# Altium project ECE453-SPI.PrjPcb
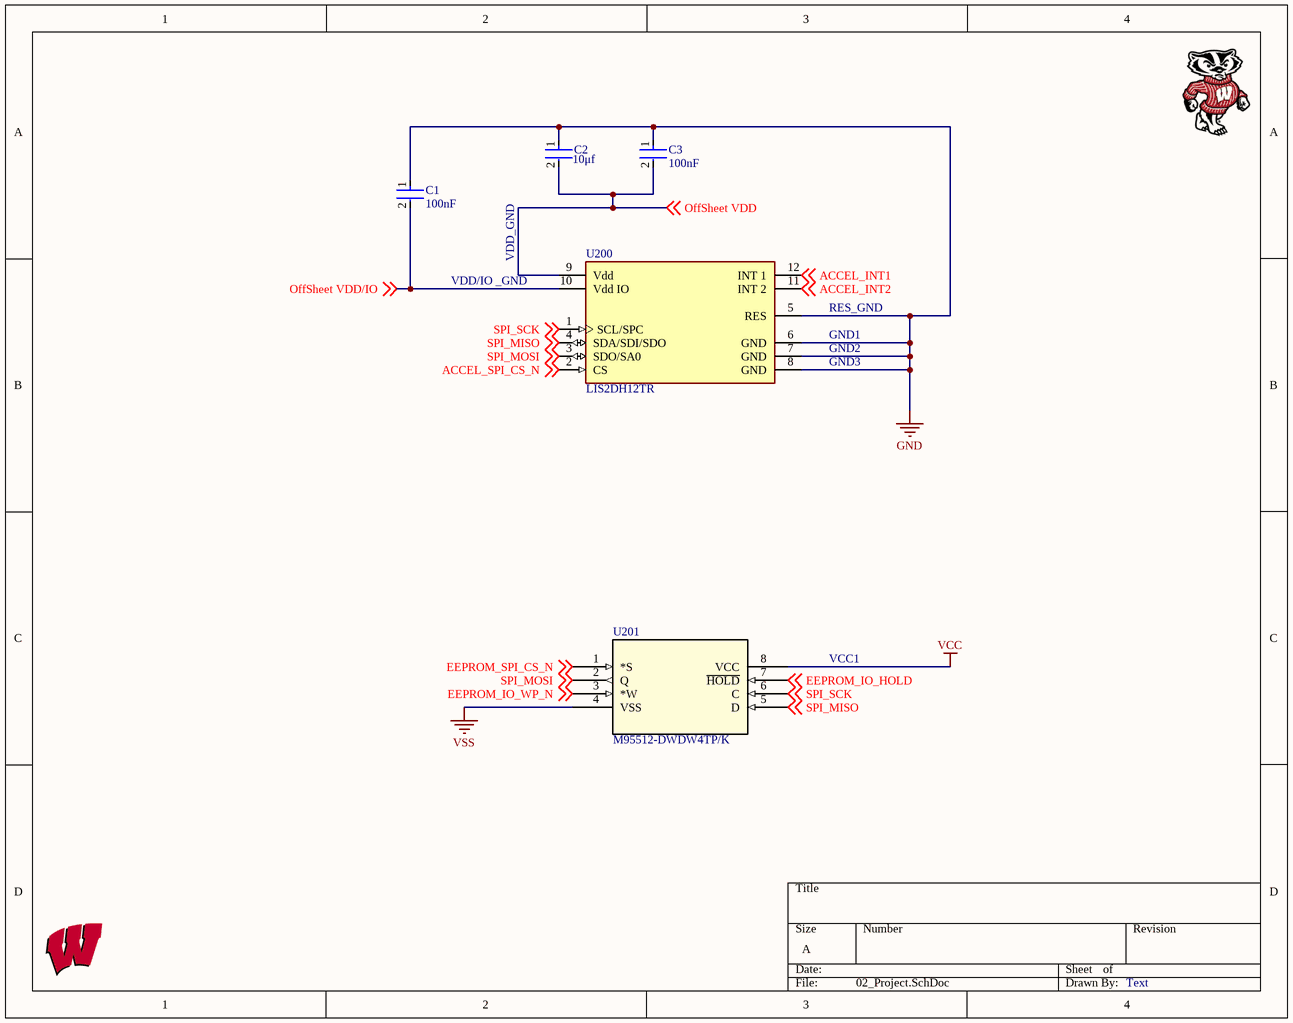
[diagram p0: 02_Project.SchDoc]
3 sheets, 28 parts. Net scope: global (net labels, ports and power ports of the same name join across sheets).
Board file: ECE453.PcbDoc
Sheets:
  02_Project.SchDoc
  03_Mechanicals.SchDoc
  SPI Title Page.SchDoc

## Sheet 02_Project.SchDoc
size A; ApprovedDate: 04/02/2019; AssemblyNumber: ECE315-F19

### Parts
C1  100nF  [FP-C0805C-DN-MFG]
C2  10μf  [FP-GRM21B-0_15-IPC_C]
C3  100nF  [FP-C0805C-DN-MFG]
U200  LIS2DH12TR  [FP-LGA-12-8365767-MFG]
U201  M95512-DWDW4TP/K  [TSSOP8_169MILS_DW_STM-M]

### Nets
GND: C1.1 C2.1 C3.1 U200.5(RES) U200.6(GND) U200.7(GND) U200.8(GND)
VCC: U201.8(VCC)
VSS: U201.4(VSS)
ACCEL_INT1: U200.12(INT_1) ; off-sheet ACCEL_INT1
ACCEL_INT2: U200.11(INT_2) ; off-sheet ACCEL_INT2
ACCEL_SPI_CS_N: U200.2(CS) ; off-sheet ACCEL_SPI_CS_N
EEPROM_IO_HOLD: U201.7(~{HOLD}) ; off-sheet EEPROM_IO_HOLD
EEPROM_IO_WP_N: U201.3(*W) ; off-sheet EEPROM_IO_WP_N
EEPROM_SPI_CS_N: U201.1(*S) ; off-sheet EEPROM_SPI_CS_N
OffSheet VDD: C2.2 C3.2 U200.9(Vdd) ; off-sheet OffSheet VDD
OffSheet VDD/IO: C1.2 U200.10(Vdd_IO) ; off-sheet OffSheet VDD/IO
SPI_MISO: U200.4(SDA/SDI/SDO) U201.5(D) ; off-sheet SPI_MISO
SPI_MOSI: U200.3(SDO/SA0) U201.2(Q) ; off-sheet SPI_MOSI
SPI_SCK: U200.1(SCL/SPC) U201.6(C) ; off-sheet SPI_SCK

### Notes on the sheet
- VDD/IO _GND
- VDD_GND
- GND1
- GND2
- GND3
- RES_GND
- VCC1
- Text

### Library data of the parts
C1 C3 = CMP-2007-00279-2: CAP CER 0.1UF 50V X7R 0805; Manufacturer Part Number: C0805C104K5RACTU; Manufacturer: KEMET; Value: 0.10 μF; Tolerance: 0.1; Temperature Coefficient: 30ppm/°C; Material: Ceramic; Device Class L2: Capacitors; Temperature Range Low: -55°C; Voltage Rating: 50 V; Digikey Description: CAP CER 0.1UF 50V X7R 0805; Category: Cap; ComponentLink2Description: Datasheet; Octopart: https://octopart.com/c0805c104k5ractu-kemet-143926; RoHS: TRUE; ComponentLink2URL: https://content.kemet.com/datasheets/KEM_C1003_C0G_SMD.pdf; Temperature Characteristic: X7R; Temperature: -55°C to +125°C; Height: 0.88mm; Temperature Range High: +125°C; Device Class L1: Passive Components; Automotive: No; Lead Free: Yes; Ipc Land Pattern Name: CAPC200125X78; Device Class L3: Ceramic Capacitors; Mouser Description: Cap Ceramic 0.1uF 50V X7R 10% SMD 2.0 x 1.2 mm 125 C Paper T/R; Capacitance: 0.10 μF; Package: C0805C-DN
C2 = CMP-2007-03541-2: Chip Multilayer Ceramic Capacitors for General Purpose, 0805, 10uF, X5R, 15%, 10%, 25V; Parameter 1: C1; Length: 2mm; Depth: 1.25mm; Termination: SMD/SMT; Voltage: 25V; Height: 1.25mm; Material: Ceramic; Thickness: 0.053inch; Radiation Hardening: No; Min Operating Temperature: -55°C; Width: 0.049inch; Package Quantity: 1; Mount: Surface Mount; Dielectric: X5R; Packaging: Tape and Reel; Capacitance: 10uF; Voltage Rating (DC): 25V; Lead Free: Lead Free; Max Operating Temperature: 85°C; Case Code (Imperial): 0805; Case/Package: 0805; Tolerance: 10%; Voltage Rating: 25V; Case Code (Metric): 2012
U200 = CMP-2000-05369-2: ACCEL 2-16G I2C/SPI 12LGA; Manufacturer 1: STMicroelectronics; Output Type: SPI; Axis: X, Y, Z; Interface: I2C; Max Supply Voltage: 3.6V; Bandwidth: 672Hz; Min Supply Voltage: 1.71V; Min Operating Temperature: -40°C; Width: 2.15mm; Lead Free: Lead Free; Case/Package: LGA; Contact Plating: Gold; Number of Pins: 12; Max Operating Temperature: 85°C; Packaging: Cut Tape; Radiation Hardening: No; Length: 2.15mm; REACH SVHC: No SVHC; Height: 1mm; Mount: Surface Mount; Supplier 1: Digi-Key; Supplier Part Number 1: 497-14851-1-ND; Manufacturer Part Number 1: LIS2DH12TR; RoHS: Yes; Category: Accelerometers; Stock 1: 3389; Pricing 1: 1=2.11000, 10=1.89800, 25=1.79080, 100=1.52590, 500=1.25364, 1000=1.19394 (USD); Series: -; Reach SVHC Compliant: Yes; RoHS Compliant: Yes; ComponentLink1URL: https://datasheet.ciiva.com/46423/1836729-46423946.pdf?src-supplier=Element14; ComponentLink1Description: https://datasheet.ciiva.com/46423/1836729-46423946.pdf?src-supplier=Element14
U201 = M95512-DWDW4TP/K: EEPROM Serial-SPI 512K-bit 64K x 8 3.3V/5V Automotive 8-Pin TSSOP T/R; Mfr_Name: STMicroelectronics; Interface: SPI,Serial; Access Time: 25ns; Density: 512Kb; Frequency: 10MHz; Min Supply Voltage: 2.5V; Max Supply Voltage: 5.5V; Max Frequency: 16MHz; Nominal Supply Current: 4mA; Copyright: Copyright (C) 2022 Ultra Librarian. All rights reserved.; Manufacturer_Part_Number: M95512-DWDW4TP/K; RefDes: RefDes; Type: DEV; Supplier 1: Digi-Key; Supplier Part Number 1: 497-14459-1-ND; Manufacturer 1: STMicroelectronics; Manufacturer Part Number 1: M95512-DWDW4TP/K; RoHS: Yes; Category: EEPROM; Stock 1: 11469; Pricing 1: 1=2.30000, 10=2.07100, 25=2.03920, 50=2.03400, 100=1.81740, 250=1.76084 (USD); Mount: Surface Mount; Case/Package: TSSOP; Number of Pins: 8; Min Operating Temperature: -40°C; Max Operating Temperature: 145°C; Packaging: Tape and Reel; Memory Type: EEPROM; Radiation Hardening: No; RoHS Compliant: Yes; ComponentLink1URL: https://datasheet.ciiva.com/29614/dm00046608-29614432.pdf?src-supplier=Digi-Key; ComponentLink1Description: https://datasheet.ciiva.com/29614/dm00046608-29614432.pdf?src-supplier=Digi-Key; ComponentLink2URL: https://datasheet.ciiva.com/48501/dm00046608-48501612.pdf?src-supplier=Avnet; ComponentLink2Description: https://datasheet.ciiva.com/48501/dm00046608-48501612.pdf?src-supplier=Avnet

## Sheet 03_Mechanicals.SchDoc
size A; ApprovedDate: 04/02/2019; AssemblyNumber: ECE315-F19
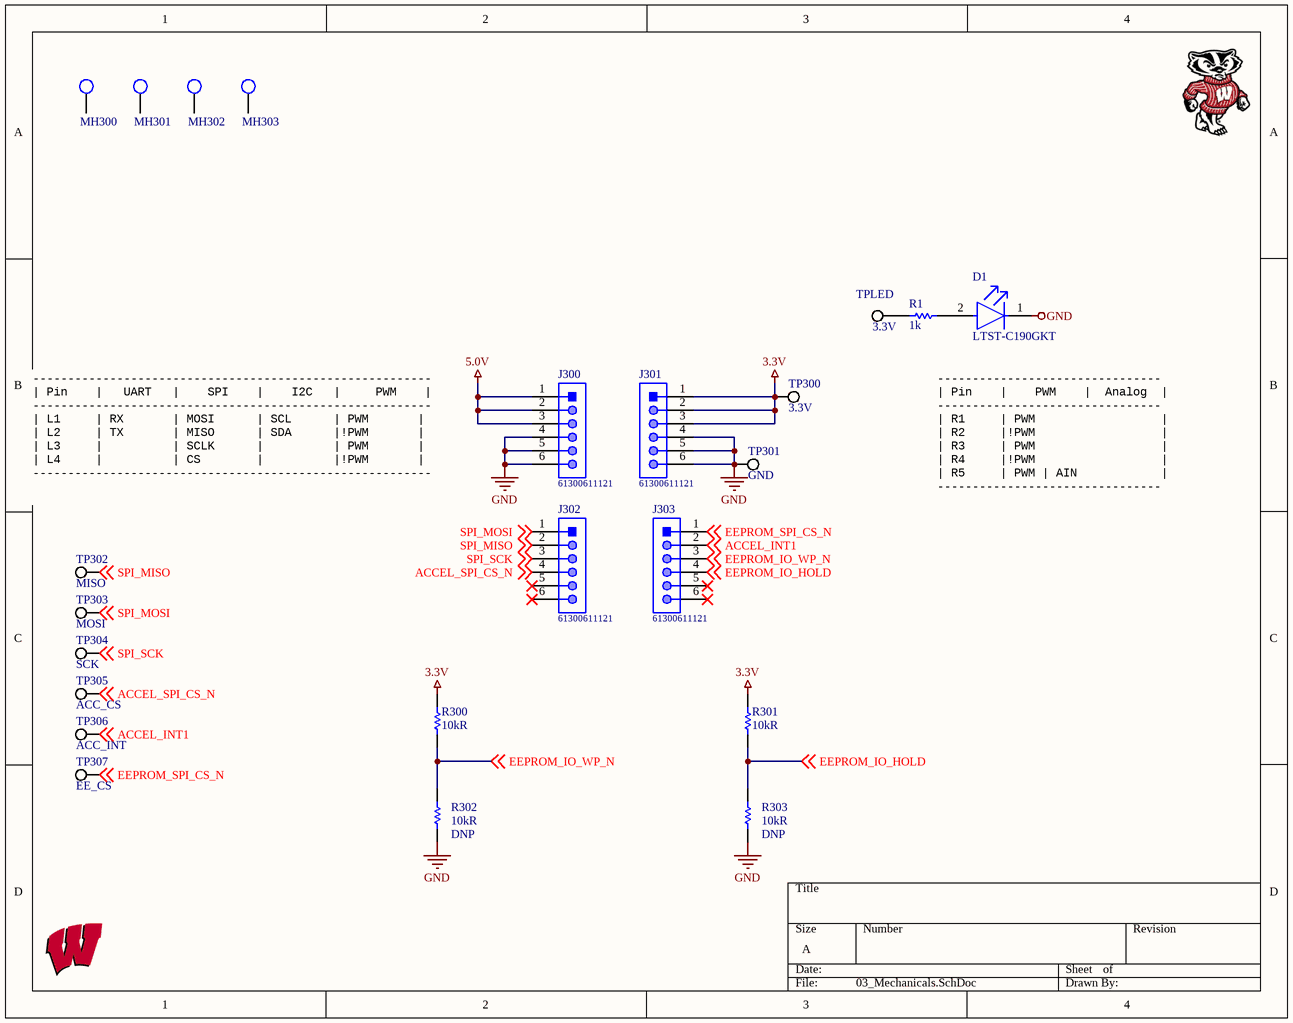
[diagram p1: 03_Mechanicals.SchDoc]

### Parts
D1  LTST-C190GKT  [FP-LTST-C190GKT-MFG]
J300  61300611121  [61300611121]
J301  61300611121  [61300611121]
J302  61300611121  [61300611121]
J303  61300611121  [61300611121]
MH300  MHOLE_2_55MM  [MHOLE_2_55MM]  (value not drawn)  (no BOM)
MH301  MHOLE_2_55MM  [MHOLE_2_55MM]  (value not drawn)  (no BOM)
MH302  MHOLE_2_55MM  [MHOLE_2_55MM]  (value not drawn)  (no BOM)
MH303  MHOLE_2_55MM  [MHOLE_2_55MM]  (value not drawn)  (no BOM)
R1  1k  [RESC2013X60X35ML10T20]
R300  Resistance: 10kR  [RESC2013X60X35NL10T20]  (hidden comment: RC0805FR-0710KL)
R301  Resistance: 10kR  [RESC2013X60X35NL10T20]  (hidden comment: RC0805FR-0710KL)
R302  DNP  Resistance: 10kR  [RESC2013X60X35NL10T20]  (no BOM)
R303  DNP  Resistance: 10kR  [RESC2013X60X35NL10T20]  (no BOM)
TP300  3.3V  [KSTN-5019_V]
TP301  GND  [KSTN-5019_V]
TP302  MISO  [KSTN-5019_V]
TP303  MOSI  [KSTN-5019_V]
TP304  SCK  [KSTN-5019_V]
TP305  ACC_CS  [KSTN-5019_V]
TP306  ACC_INT  [KSTN-5019_V]
TP307  EE_CS  [KSTN-5019_V]
TPLED  3.3V  [KSTN-5019_V]

### Nets
3.3V: J301.1 J301.2 J301.3 R300.1 R301.1 TP300.1
5.0V: J300.1 J300.2 J300.3
GND: D1.1(C) J300.4 J300.5 J300.6 J301.4 J301.5 J301.6 R302.2 R303.2 TP301.1
ACCEL_INT1: J303.2 TP306.1 ; off-sheet ACCEL_INT1
ACCEL_SPI_CS_N: J302.4 TP305.1 ; off-sheet ACCEL_SPI_CS_N
EEPROM_IO_HOLD: J303.4 R301.2 R303.1 ; off-sheet EEPROM_IO_HOLD
EEPROM_IO_WP_N: J303.3 R300.2 R302.1 ; off-sheet EEPROM_IO_WP_N
EEPROM_SPI_CS_N: J303.1 TP307.1 ; off-sheet EEPROM_SPI_CS_N
SPI_MISO: J302.2 TP302.1 ; off-sheet SPI_MISO
SPI_MOSI: J302.1 TP303.1 ; off-sheet SPI_MOSI
SPI_SCK: J302.3 TP304.1 ; off-sheet SPI_SCK
NetD1_2: D1.2(A) R1.1
NetR1_2: R1.2 TPLED.1

Not connected (* = marked no-connect by the designer): J302 5* 6*; J303 5* 6*; MH300 1; MH301 1; MH302 1; MH303 1

### Notes on the sheet
- ---------------------------------------------------------
  | Pin    |   UART   |    SPI    |    I2C   |     PWM    |
  ---------------------------------------------------------
  | L1     | RX       | MOSI      | SCL      | PWM       |
  | L2     | TX       | MISO      | SDA      |!PWM       |
  | L3     |          | SCLK      |          | PWM       |
  | L4     |          | CS        |          |!PWM       |
  ---------------------------------------------------------
- --------------------------------
  | Pin    |    PWM    |  Analog  |
  --------------------------------
  | R1     | PWM                  |
  | R2     |!PWM                  |
  | R3     | PWM                  |
  | R4     |!PWM                  |
  | R5     | PWM | AIN            |
  --------------------------------

### Library data of the parts
D1 = CMP-22017-000005-2: LED GREEN CLEAR CHIP SMD; Dominant Wavelength: 569nm; Reverse Voltage: 5V; Lens Color: Colorless; Viewing Angle: 130°; Voltage: 2V; Forward Current: 30mA; Power Dissipation: 100mW; Luminous Intensity: 6mcd; Number of LEDs: 1; Forward Voltage: 2.1V; Wavelength: 565nm; Test Current: 10mA; Min Operating Temperature: -55°C; Lens Style: Clear; Mount: Surface Mount; Width: 0.8mm; Packaging: Tape and Reel; Lens Transparency: Clear; Case Code (Metric): 1608; Depth: 0.8mm; Case Code (Imperial): 0603; Case/Package: 0603; Number of Pins: 2; Max Operating Temperature: 85°C; Lead Free: Lead Free; Number of Elements: 1; Length: 1.6mm; Height: 0.8mm; Package Quantity: 1; Power Rating: 100mW; Radiation Hardening: No; Illumination Color: Green; Color: Green
J300-J303 = CMP-1502-01070-1: THT Vertical Pin Header WR-PHD, Pitch 2.54 mm, Single Row, 6 pins; Manufacturer: Wurth Elektronik; Manufacturer 1: Wurth Electronics; Gender: Male; Pin Number: 6; Pitch: 2.54mm; Working Voltage: 250VAC; Rated Current: 3A; Withstanding Voltage: 500VAC; Contact Resistance: 20mOhm; Voltage Rating: 250V; Connector Type: Male Pin; Operating Temperature: -40to105degC; Packaging: Bag; Datasheet URL: https://katalog.we-online.de/em/datasheet/6130xx11121.pdf; Package Reference: 61300611121; Mounting Technology: THT; Publisher: WurthElektronik; Part Number: 61300611121; Manufacturer URL: http://www.we-online.de; Row Number: Single; Orientation: Vertical; Supplier 1: Digi-Key; Supplier Part Number 1: 732-5319-ND; Manufacturer Part Number 1: 61300611121; RoHS: Yes; Category: Headers and Wire Housings; Stock 1: 51753; Pricing 1: 1=0.35000, 10=0.29800, 25=0.24720, 50=0.20700, 100=0.18700, 1000=0.17100 (USD); Mount: Through Hole; Contact Plating: Gold; Contact Material: Copper Alloy,Copper; Housing Material: PBT; Color: Black; Min Operating Temperature: -40°C; Max Operating Temperature: 125°C; Number of Rows: 1; Contact Gender: Male; Current Rating: 3A; Number of Positions: 6; Termination: Through Hole; Number of Contacts: 6; Series: WR-PHD; Contact Type: Male Pin; Contact Mating Length: 0.236inch; Lead Free: Lead Free; RoHS Compliant: Yes; ComponentLink1URL: http://www.mouser.com/ds/2/445/6130xx11121-538006.pdf?src-supplier=Mouser; ComponentLink1Description: http://www.mouser.com/ds/2/445/6130xx11121-538006.pdf?src-supplier=Mouser; ComponentLink2URL: http://www.farnell.com/cad/1737268.pdf?src-supplier=Element14; ComponentLink2Description: http://www.farnell.com/cad/1737268.pdf?src-supplier=Element14; ComponentLink3URL: https://katalog.we-online.de/em/datasheet/6130xx11121.pdf?src-supplier=Digi-Key; ComponentLink3Description: https://katalog.we-online.de/em/datasheet/6130xx11121.pdf?src-supplier=Digi-Key
MH300-MH303 = MHOLE_2_55MM: Mounting Holde; Manufacturer Part Number: UW MTHOLE
R1 = CMP-2100-03671-1: Chip Resistor, 1 KOhm, +/- 1%, 125 mW, -55 to 155 degC, 0805 (2012 Metric), RoHS, Tape and Reel; Manufacturer: Yageo; Temperature Coefficient: 100ppm/degreesC; Voltage Rating (DC): 150V; Max Power Dissipation: 125mW; Resistance: 1KOhm; Number of Pins: 2; Number of Terminations: 2; Datasheet URL: http://www.yageo.com/NewPortal/yageodocoutput?fileName=/pdf/R-Chip/PYu-RC_Group_51_RoHS_L_5.pdf; Length: 0.079inch; Package Description: 2-Pin Surface Mounted Device, Body 2 x 1.25 mm; Depth: 1.25mm; Height: 0.024inch; Military Standard: Not; Case/Package: 0805; Package Reference: 0805; RoHSCompliant: true; Lead Free: LeadFree; Packaging: TapeandReel; Package Quantity: 1; Datasheet Version: Rev. 5, 10/2016; Tolerance: 1%; Min Operating Temperature: -55degC; Voltage Rating: 150V; Composition: ThickFilm; Case Code (Imperial): 0805; Power Rating: 125mW; Width: 0.049inch; Case Code (Metric): 2012; Manufacturer URL: http://www.yageo.com/; Max Operating Temperature: 155degC; REACH SVHC: Unknown; Termination: SMD/SMT
R300 R301 = CMP-1659-00013-4: Chip Resistor, 10 KOhm, +/- 1%, 0.125 W, -55 to 155 degC, 0805 (2012 Metric), RoHS, Tape and Reel; Manufacturer: Yageo; Voltage Rating: 150 V; Power Rating: 125mW; Temperature Coefficient: 100ppm/°C; Mount: Surface Mount; ComponentLink1Description: Manufacturer URL; ComponentLink2URL: http://www.yageo.com/documents/recent/PYu-RC_Group_51_RoHS_L_04.pdf; Pins: 2; Length: 2 mm; Min Operating Temperature: -55 degC; Height: 0.5 mm; Mounting Technology: Surface Mount; RoHSCompliant: true; REACH SVHC: No SVHC; ComponentLink1URL: http://www.yageo.com/; Max Operating Temperature: 155 degC; PackageReference: 0805; DatasheetVersion: Rev. 4, 02/2016; Package Quantity: 5000; Packaging: Tape and Reel; ComponentLink2Description: Datasheet; PackageDescription: 2-Pin Surface Mounted Device, Body 2 x 1.25 mm; Supplier 1: Digi-Key; Supplier Part Number 1: 311-10.0KCRCT-ND; Manufacturer 1: Yageo; Manufacturer Part Number 1: RC0805FR-0710KL; RoHS: Yes; Category: Chip SMD Resistors; Stock 1: 12202331; Pricing 1: 1=0.10000, 10=0.03700, 100=0.01520, 1000=0.00682, 2500=0.00592 (USD); Case/Package: 0805; Case Code (Imperial): 0805; Case Code (Metric): 2012; Size Code: 0805; Tolerance: 1%; Termination: SMD/SMT; Series: RC; Max Power Dissipation: 125mW; Resistance Tolerance: 1%; Resistor Type: Thick Film; Number of Terminations: 2; Features: Moisture Resistant; Construction: Rectangular; Technology: THICK FILM; Width: 0.049inch; Depth: 1.25mm; RoHS Compliant: Yes; Lead Free: Lead Free; Military Standard: Not
R302 R303 = CMP-1659-00013-4: Chip Resistor, 10 KOhm, +/- 1%, 0.125 W, -55 to 155 degC, 0805 (2012 Metric), RoHS, Tape and Reel; Manufacturer: Yageo; Manufacturer Part Number 1: RC0805FR-0710KL; Voltage Rating: 150 V; Power Rating: 125mW; Temperature Coefficient: 100ppm/°C; Mount: Surface Mount; ComponentLink1Description: Manufacturer URL; ComponentLink2URL: http://www.yageo.com/documents/recent/PYu-RC_Group_51_RoHS_L_04.pdf; Pins: 2; Length: 2 mm; Min Operating Temperature: -55 degC; Height: 0.5 mm; Mounting Technology: Surface Mount; RoHSCompliant: true; REACH SVHC: No SVHC; ComponentLink1URL: http://www.yageo.com/; Max Operating Temperature: 155 degC; PackageReference: 0805; DatasheetVersion: Rev. 4, 02/2016; Package Quantity: 5000; Packaging: Tape and Reel; ComponentLink2Description: Datasheet; PackageDescription: 2-Pin Surface Mounted Device, Body 2 x 1.25 mm; Supplier 1: Digi-Key; Supplier Part Number 1: 311-10.0KCRCT-ND; Manufacturer 1: Yageo; RoHS: Yes; Category: Chip SMD Resistors; Stock 1: 12202331; Pricing 1: 1=0.10000, 10=0.03700, 100=0.01520, 1000=0.00682, 2500=0.00592 (USD); Case/Package: 0805; Case Code (Imperial): 0805; Case Code (Metric): 2012; Size Code: 0805; Tolerance: 1%; Termination: SMD/SMT; Series: RC; Max Power Dissipation: 125mW; Resistance Tolerance: 1%; Resistor Type: Thick Film; Number of Terminations: 2; Features: Moisture Resistant; Construction: Rectangular; Technology: THICK FILM; Width: 0.049inch; Depth: 1.25mm; RoHS Compliant: Yes; Lead Free: Lead Free; Military Standard: Not
TP300-TP307 TPLED = CMP-1672-00008-1: Test Point, 1 Position SMD, RoHS, Tape and Reel; Manufacturer 1: Keystone Electronics; Manufacturer Part Number 1: 5019; Body Material: Bronze; Plating: Silver; ComponentLink1Description: Manufacturer URL; Package Quantity: 1000; DatasheetVersion: 03/2014; Packaging: Tape and Reel; ComponentLink2URL: http://www.keyelco.com/product-pdf.cfm?p=1357; ComponentLink1URL: http://www.keyelco.com/; Mount: Surface Mount; Contact Plating: Silver; PackageDescription: 1-Pin Surface Mount Device, Body 3.81 x 2.03 mm; Pins: 1; RoHSCompliant: True; Mounting Technology: Surface Mount; ComponentLink2Description: Datasheet; PackageReference: 5019; Supplier 1: Digi-Key; Supplier Part Number 1: 36-5019CT-ND; RoHS: Yes; Category: Connectors; Stock 1: 1127181; Pricing 1: 1=0.34000, 25=0.27360, 100=0.22340, 250=0.20064, 500=0.19152 (USD); Number of Pins: 1; Material: Bronze; Contact Material: Bronze; Series: 5019; Termination: SMD/SMT; Height: 0.09inch; RoHS Compliant: Yes; Reach SVHC Compliant: Yes; Lead Free: Lead Free; ComponentLink3URL: https://datasheet.ciiva.com/16318/m60-2p61-16318395.pdf?src-supplier=Future+Electronics; ComponentLink3Description: https://datasheet.ciiva.com/16318/m60-2p61-16318395.pdf?src-supplier=Future+Electronics; ComponentLink4URL: https://datasheet.ciiva.com/16885/70182998-16885945.pdf?src-supplier=Allied+Electronics; ComponentLink4Description: https://datasheet.ciiva.com/16885/70182998-16885945.pdf?src-supplier=Allied+Electronics; ComponentLink5URL: https://datasheet.ciiva.com/14848/m60-2p61-14848437.pdf?src-supplier=Digi-Key; ComponentLink5Description: https://datasheet.ciiva.com/14848/m60-2p61-14848437.pdf?src-supplier=Digi-Key; ComponentLink6URL: https://datasheet.ciiva.com/14848/m60-2p61-14848438.pdf?src-supplier=Digi-Key; ComponentLink6Description: https://datasheet.ciiva.com/14848/m60-2p61-14848438.pdf?src-supplier=Digi-Key; ComponentLink7URL: https://datasheet.ciiva.com/14848/m60-2p61-14848439.pdf?src-supplier=Digi-Key; ComponentLink7Description: https://datasheet.ciiva.com/14848/m60-2p61-14848439.pdf?src-supplier=Digi-Key

## Sheet SPI Title Page.SchDoc
size A
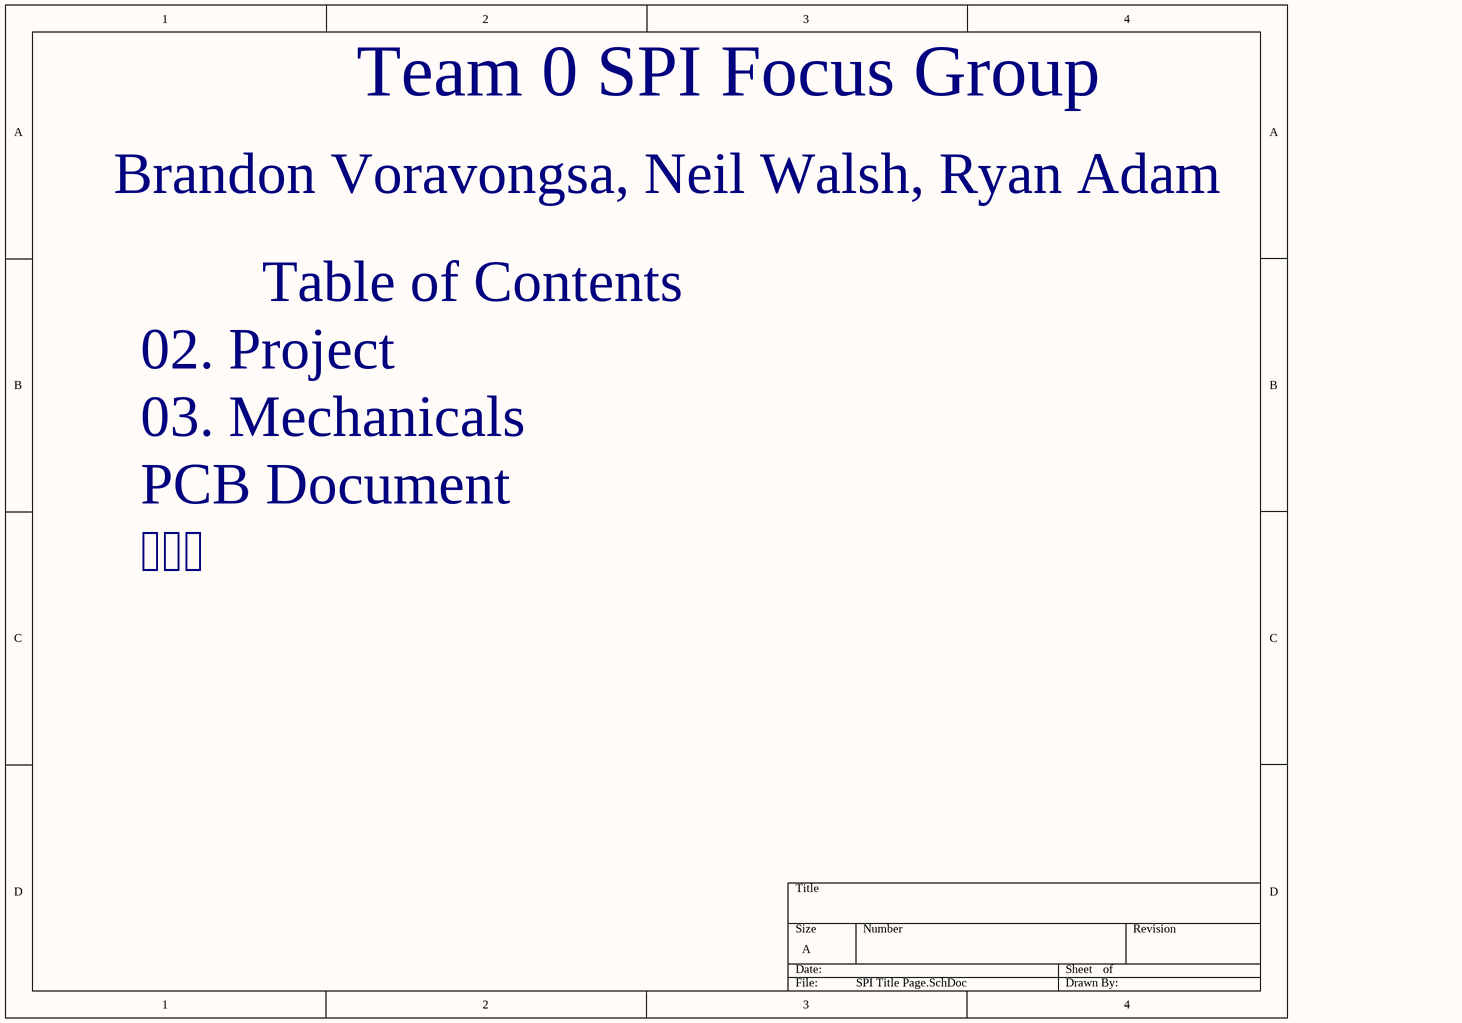
[diagram p2: SPI Title Page.SchDoc]

### Notes on the sheet
- Team 0 SPI Focus Group
- Brandon Voravongsa, Neil Walsh, Ryan Adam
- Table of Contents
- 02. Project
- 03. Mechanicals
- PCB Document
- 

## Nets that join several sheets
GND: 02_Project (7 pins), 03_Mechanicals (10 pins)
ACCEL_INT1: 02_Project (U200.12), 03_Mechanicals (J303.2 TP306.1)
ACCEL_SPI_CS_N: 02_Project (U200.2), 03_Mechanicals (J302.4 TP305.1)
EEPROM_IO_HOLD: 02_Project (U201.7), 03_Mechanicals (J303.4 R301.2 R303.1)
EEPROM_IO_WP_N: 02_Project (U201.3), 03_Mechanicals (J303.3 R300.2 R302.1)
EEPROM_SPI_CS_N: 02_Project (U201.1), 03_Mechanicals (J303.1 TP307.1)
SPI_MISO: 02_Project (U200.4 U201.5), 03_Mechanicals (J302.2 TP302.1)
SPI_MOSI: 02_Project (U200.3 U201.2), 03_Mechanicals (J302.1 TP303.1)
SPI_SCK: 02_Project (U200.1 U201.6), 03_Mechanicals (J302.3 TP304.1)